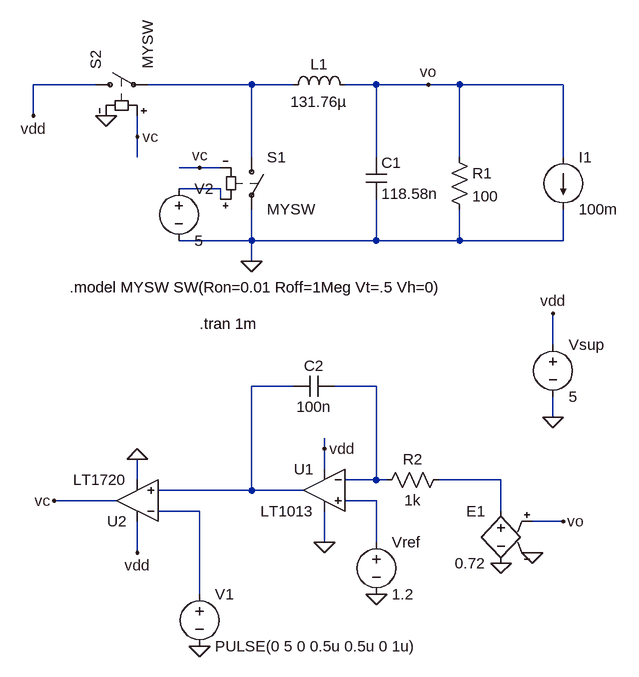
[diagram p0: schematic buck_close.asc]
buck_close.asc, the LTspice schematic file:
Version 4
SHEET 1 880 868
WIRE -160 -16 -256 -16
WIRE 80 -16 -80 -16
WIRE 144 -16 80 -16
WIRE 272 -16 224 -16
WIRE 352 -16 272 -16
WIRE 400 -16 352 -16
WIRE 560 -16 400 -16
WIRE -256 32 -256 -16
WIRE -96 64 -96 32
WIRE -96 96 -96 64
WIRE 80 96 80 -16
WIRE 272 96 272 -16
WIRE 400 96 400 -16
WIRE 560 96 560 -16
WIRE 0 112 -32 112
WIRE 32 112 0 112
WIRE 32 144 -32 144
WIRE 32 160 32 144
WIRE 80 224 80 176
WIRE 80 224 -32 224
WIRE 272 224 272 160
WIRE 272 224 80 224
WIRE 400 224 400 176
WIRE 400 224 272 224
WIRE 560 224 560 176
WIRE 560 224 400 224
WIRE 80 256 80 224
WIRE 544 384 544 336
WIRE 144 448 80 448
WIRE 272 448 208 448
WIRE 544 496 544 464
WIRE 192 544 192 528
WIRE 192 576 192 544
WIRE -96 592 -96 560
WIRE 272 592 272 448
WIRE 272 592 224 592
WIRE 288 592 272 592
WIRE 464 592 368 592
WIRE 80 608 80 448
WIRE 80 608 -64 608
WIRE 160 608 80 608
WIRE -128 624 -224 624
WIRE 272 624 224 624
WIRE 0 640 -64 640
WIRE 464 640 464 592
WIRE 560 656 512 656
WIRE 192 688 192 640
WIRE 272 688 272 624
WIRE -96 704 -96 656
WIRE 0 768 0 640
FLAG -144 32 0
FLAG 80 256 0
FLAG -96 64 vc
FLAG 0 112 vc
FLAG 352 -16 vo
FLAG 512 704 0
FLAG 464 720 0
FLAG 272 768 0
FLAG 192 544 vdd
FLAG 0 848 0
FLAG 560 656 vo
FLAG -96 560 0
FLAG -224 624 vc
FLAG 544 496 0
FLAG 544 336 vdd
FLAG -96 704 vdd
FLAG 192 688 0
FLAG -256 32 vdd
SYMBOL sw 80 80 R0
SYMATTR InstName S1
SYMATTR Value MYSW
SYMBOL sw -176 -16 R270
SYMATTR InstName S2
SYMATTR Value MYSW
SYMBOL ind 128 0 R270
WINDOW 0 32 56 VTop 2
WINDOW 3 5 56 VBottom 2
SYMATTR InstName L1
SYMATTR Value 131.76µ
SYMBOL cap 256 96 R0
SYMATTR InstName C1
SYMATTR Value 118.58n
SYMBOL res 384 80 R0
SYMATTR InstName R1
SYMATTR Value 100
SYMBOL voltage -32 128 R0
WINDOW 123 0 0 Left 0
WINDOW 39 0 0 Left 0
SYMATTR InstName V2
SYMATTR Value 5
SYMBOL current 560 96 R0
WINDOW 123 0 0 Left 0
WINDOW 39 0 0 Left 0
SYMATTR InstName I1
SYMATTR Value 100m
SYMBOL Opamps\\LT1013 192 544 M0
SYMATTR InstName U1
SYMBOL res 384 576 R90
WINDOW 0 0 56 VBottom 2
WINDOW 3 32 56 VTop 2
SYMATTR InstName R2
SYMATTR Value 1k
SYMBOL e 464 624 M0
SYMATTR InstName E1
SYMATTR Value 0.72
SYMBOL voltage 272 672 R0
SYMATTR InstName Vref
SYMATTR Value 1.2
SYMBOL cap 208 432 R90
WINDOW 0 0 32 VBottom 2
WINDOW 3 32 32 VTop 2
SYMATTR InstName C2
SYMATTR Value 100n
SYMBOL voltage 0 752 R0
WINDOW 123 0 0 Left 0
WINDOW 39 0 0 Left 0
SYMATTR InstName V1
SYMATTR Value PULSE(0 5 0 0.5u 0.5u 0 1u)
SYMBOL Comparators\\LT1720 -96 688 R180
SYMATTR InstName U2
SYMBOL voltage 544 368 R0
WINDOW 123 0 0 Left 0
WINDOW 39 0 0 Left 0
SYMATTR InstName Vsup
SYMATTR Value 5
TEXT -200 296 Left 2 !.model MYSW SW(Ron=0.01 Roff=1Meg Vt=.5 Vh=0)
TEXT 0 352 Left 2 !.tran 1m

The netlist it stands for:
* buck_close.asc
S1 N001 0 N002 vc MYSW
S2 vdd N001 vc 0 MYSW
L1 N001 vo 131.76µ
C1 vo 0 118.58n
R1 vo 0 100
V2 N002 0 5
I1 vo 0 100m
XU1 N006 N004 vdd 0 N003 LT1013  ; pins In+ In- V+ V- OUT
R2 N005 N004 1k
E1 N005 0 vo 0 0.72
Vref N006 0 1.2
C2 N004 N003 100n
V1 N007 0 PULSE(0 5 0 0.5u 0.5u 0 1u)
XU2 N003 N007 vdd 0 vc LT1720  ; pins In+ In- V+ V- OUT
Vsup vdd 0 5
.model MYSW SW(Ron=0.01 Roff=1Meg Vt=.5 Vh=0)
.tran 1m
.lib LTC.lib
.lib LT1720.sub
.backanno
.end